# EAGLE design ExoProg (EAGLE 6.5.0)
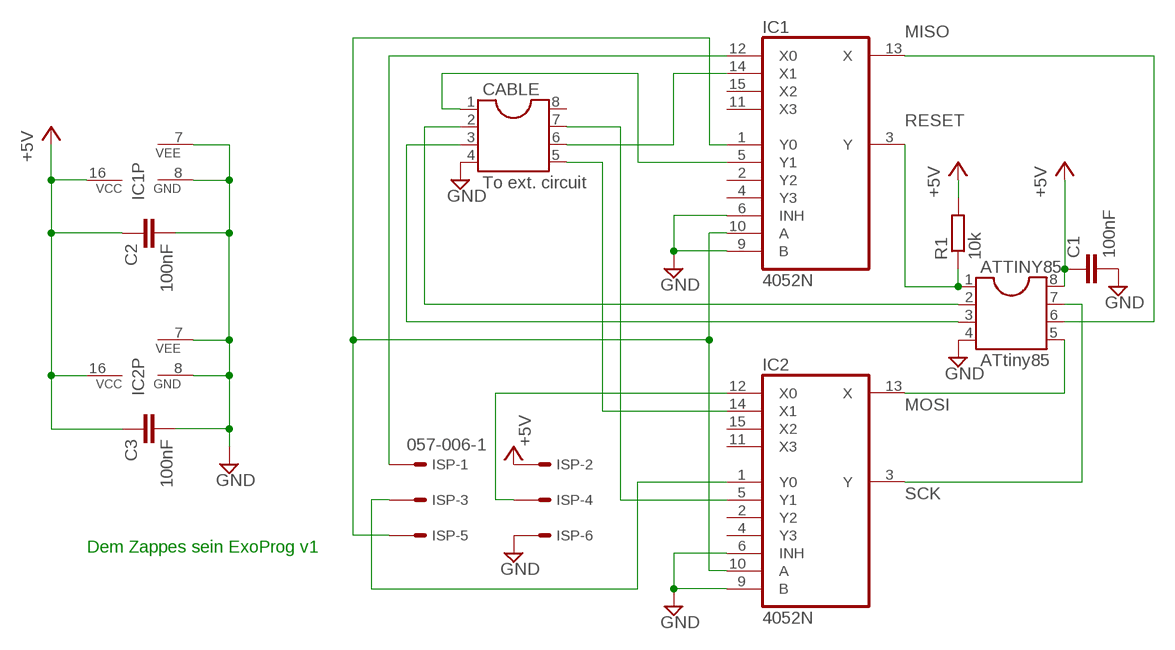
[diagram p0: schematic, sheet 1]

## Parts
ATTINY85  ATtiny85  DIL8  [DIL08]
C1  100nF  C2,5-3  [C2.5-3]
C2  100nF  C2,5-3  [C2.5-3]
C3  100nF  C2,5-3  [C2.5-3]
CABLE  To ext. circuit  DIL8  [DIL08]
IC1  4052N  [DIL16]
IC2  4052N  [DIL16]
ISP  057-006-1  [057-006-1]
R1  10k  R-EU_0207/10  [0207/10]

## Nets
+5V: ATTINY85.8 C1.1 C2.1 C3.1 IC1.16(VCC) IC2.16(VCC) ISP.2 R1.2
C_MISO: CABLE.6 IC1.14(X1)
C_MOSI: CABLE.5 IC2.14(X1)
C_RESET: CABLE.1 IC1.5(Y1)
C_SCK: CABLE.7 IC2.5(Y1)
GND: ATTINY85.4 C1.2 C2.2 C3.2 CABLE.4 IC1.6(INH) IC1.7(VEE) IC1.8(GND) IC1.9(B) IC2.6(INH) IC2.7(VEE) IC2.8(GND) IC2.9(B) ISP.6
I_MISO: IC1.12(X0) ISP.1
I_MOSI: IC2.12(X0) ISP.4
I_RESET: IC1.1(Y0) IC1.10(A) IC2.10(A) ISP.5
I_SCK: IC2.1(Y0) ISP.3
MISO: ATTINY85.6 IC1.13(X)
MOSI: ATTINY85.5 IC2.13(X)
PIN2: ATTINY85.2 CABLE.2
PIN3: ATTINY85.3 CABLE.3
RESET: ATTINY85.1 IC1.3(Y) R1.1
SCK: ATTINY85.7 IC2.3(Y)
Unconnected: CABLE.8 IC1.2(Y2) IC1.4(Y3) IC1.11(X3) IC1.15(X2) IC2.2(Y2) IC2.4(Y3) IC2.11(X3) IC2.15(X2)

## Notes on the sheet
- Dem Zappes sein ExoProg v1

## Library data of the parts
ATTINY85 CABLE = ic-package:DIL8: Dual In Line / Socket
C1-C3 = capacitor-wima:C: CAPACITOR naming: grid - package width
IC1 IC2 = 40xx:4052: Dual 4-channel ANALOG MULTIPLEXER
ISP = con-panduit:057-006-: CONNECTOR 6-pin series 057 contact pc board low profile headers; OC_FARNELL: unknown; OC_NEWARK: unknown
R1 = resistor:R-EU_: RESISTOR, European symbol

## Board
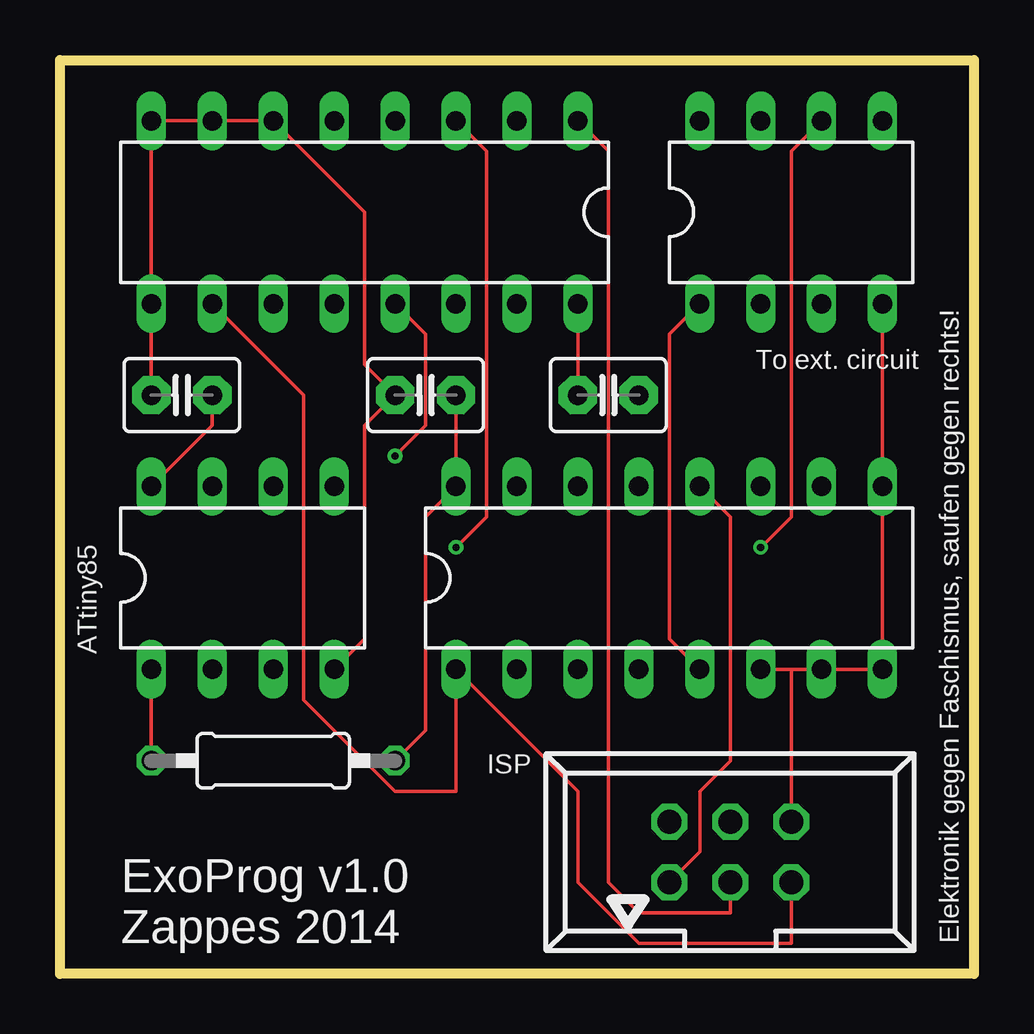
[diagram p1: board, top side]
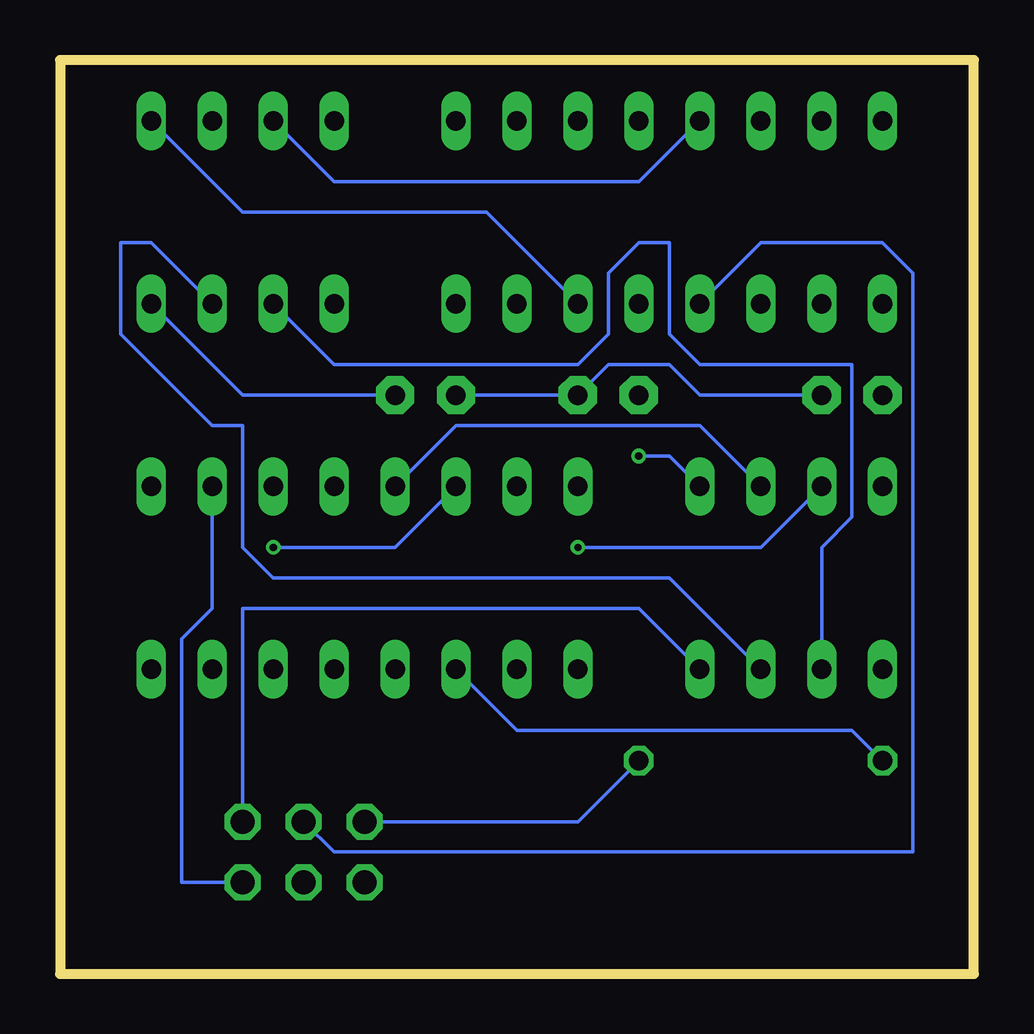
[diagram p2: board, bottom side, seen from below]

Size 38.1 x 38.1 mm. Coordinates in mm from the lower left corner, seen from the top.
Outline: 0,38.1 38.1,38.1 38.1,0 0,0 0,38.1
Copper layers (1*2*15*16): Top 0.035mm / dielectric 0.2mm / layer 2 0.0175mm / dielectric 1.1mm / layer 15 0.0175mm / dielectric 0.2mm / Bottom 0.035mm
Design rules "SeeedStudio_DRU_no_angle_20130527": minimum track width 6mil, minimum drill 12mil, track to track 6mil, track to pad 6mil, pad to pad 6mil, via to via 6mil, smd to smd 0mil, copper to edge 10mil, drill to drill 10mil, minimum pad ring 6mil, minimum via ring 6mil, stop-mask expansion 2mil, vias tented up to drill 25mil, thermal gap 10mil

### Footprints (pad centres in the part's own frame; a part is rotated, then mirrored left to right if it is on the bottom)
DIL08 = drill 0.813 long: 1 -3.81,-3.81; 2 -1.27,-3.81; 3 1.27,-3.81; 4 3.81,-3.81; 5 3.81,3.81; 6 1.27,3.81; 7 -1.27,3.81; 8 -3.81,3.81
C2.5-3 = drill 0.813 pad 1.6 octagon: 1 -1.27,0; 2 1.27,0
DIL16 = drill 0.813 long: 1 -8.89,-3.81; 2 -6.35,-3.81; 3 -3.81,-3.81; 4 -1.27,-3.81; 5 1.27,-3.81; 6 3.81,-3.81; 7 6.35,-3.81; 8 8.89,-3.81; 9 8.89,3.81; 10 6.35,3.81; 11 3.81,3.81; 12 1.27,3.81; 13 -1.27,3.81; 14 -3.81,3.81; 15 -6.35,3.81; 16 -8.89,3.81
057-006-1 = drill 1 octagon: 1 -2.54,-1.27; 2 -2.54,1.27; 3 0,-1.27; 4 0,1.27; 5 2.54,-1.27; 6 2.54,1.27
0207/10 = drill 0.813 octagon: 1 -5.08,0; 2 5.08,0

### Placement (x,y rotation side)
ATTINY85  7.62,16.51 0 top
C1  5.08,24.13 180 top
C2  15.24,24.13 180 top
C3  22.86,24.13 0 top
CABLE  30.48,31.75 0 top
IC1  25.4,16.51 0 top
IC2  12.7,31.75 180 top
ISP  27.94,5.08 0 top
R1  8.89,8.89 0 top

### Tracks (layer width: path | path; a pad name or v marks a point on that pad's centre or on a via)
+5V
  Top 0.152: ATTINY85.8 6.35,22.86 C1.1 | C2.1 IC1.16 15.24,19.05 15.24,10.16 R1.2 | C3.1 IC2.16
  Bottom 0.152: R1.2 16.51,6.35 ISP.2 | C3.1 C2.1 15.24,25.4 12.7,25.4 11.43,24.13 C1.1
C_MISO  (via drill 0.3)
  Top 0.152: v29.21,17.78 30.48,19.05 30.48,34.29 CABLE.6
  Bottom 0.152: IC1.14 24.13,17.78 v29.21,17.78
C_MOSI
  Bottom 0.152: IC2.14 20.32,31.75 30.48,31.75 CABLE.5
C_RESET
  Top 0.152: IC1.5 25.4,13.97 25.4,26.67 CABLE.1
C_SCK
  Bottom 0.152: IC2.5 13.97,33.02 26.67,33.02 CABLE.7
GND
  Top 0.152: 30.48,12.7 IC1.7 IC1.8 IC1.9 CABLE.4 | 30.48,12.7 IC1.6 | 30.48,12.7 ISP.6 | ATTINY85.4 12.7,13.97 12.7,22.86 C2.2 12.7,25.4 12.7,31.75 IC2.6 IC2.7 IC2.8 IC2.9 C1.2
  Bottom 0.152: C3.2 30.48,24.13 CABLE.4 | ISP.6 30.48,15.24 13.97,15.24 ATTINY85.4
I_MISO
  Top 0.152: IC1.12 27.94,19.05 27.94,8.89 26.67,7.62 26.67,5.08 ISP.1
I_MOSI
  Bottom 0.152: IC2.12 8.89,30.48 3.81,30.48 2.54,29.21 2.54,5.08 26.67,5.08 ISP.4
I_RESET
  Top 0.152: ISP.5 30.48,1.27 24.13,1.27 21.59,3.81 21.59,7.62 IC1.1 16.51,7.62 13.97,7.62 10.16,11.43 10.16,24.13 IC2.10
  Bottom 0.152: IC1.10 31.75,15.24 33.02,13.97 33.02,3.81 ISP.5
I_SCK
  Top 0.152: IC2.1 22.86,34.29 22.86,3.81 24.13,2.54 27.94,2.54 ISP.3
MISO
  Bottom 0.152: ATTINY85.6 11.43,22.86 21.59,22.86 IC1.13
MOSI  (via drill 0.3)
  Top 0.152: v13.97,21.59 15.24,22.86 15.24,26.67 IC2.13
  Bottom 0.152: ATTINY85.5 12.7,21.59 v13.97,21.59
PIN2
  Bottom 0.152: ATTINY85.2 6.35,17.78 5.08,19.05 5.08,25.4 11.43,25.4 12.7,26.67 12.7,30.48 13.97,30.48 15.24,29.21 15.24,26.67 16.51,25.4 26.67,25.4 CABLE.2
PIN3
  Bottom 0.152: ATTINY85.3 12.7,16.51 29.21,16.51 30.48,17.78 30.48,22.86 31.75,22.86 35.56,26.67 35.56,30.48 34.29,30.48 CABLE.3
RESET
  Top 0.152: ATTINY85.1 R1.1
  Bottom 0.152: IC1.3 19.05,10.16 5.08,10.16 R1.1
SCK  (via drill 0.3)
  Top 0.152: v16.51,17.78 17.78,19.05 17.78,34.29 IC2.3
  Bottom 0.152: ATTINY85.7 8.89,17.78 v16.51,17.78

### Text on the board
tNames: ExoProg v1.0 / Zappes 2014 | Elektronik gegen Faschismus, saufen gegen rechts!